# Altium project led-cube.PrjPcb
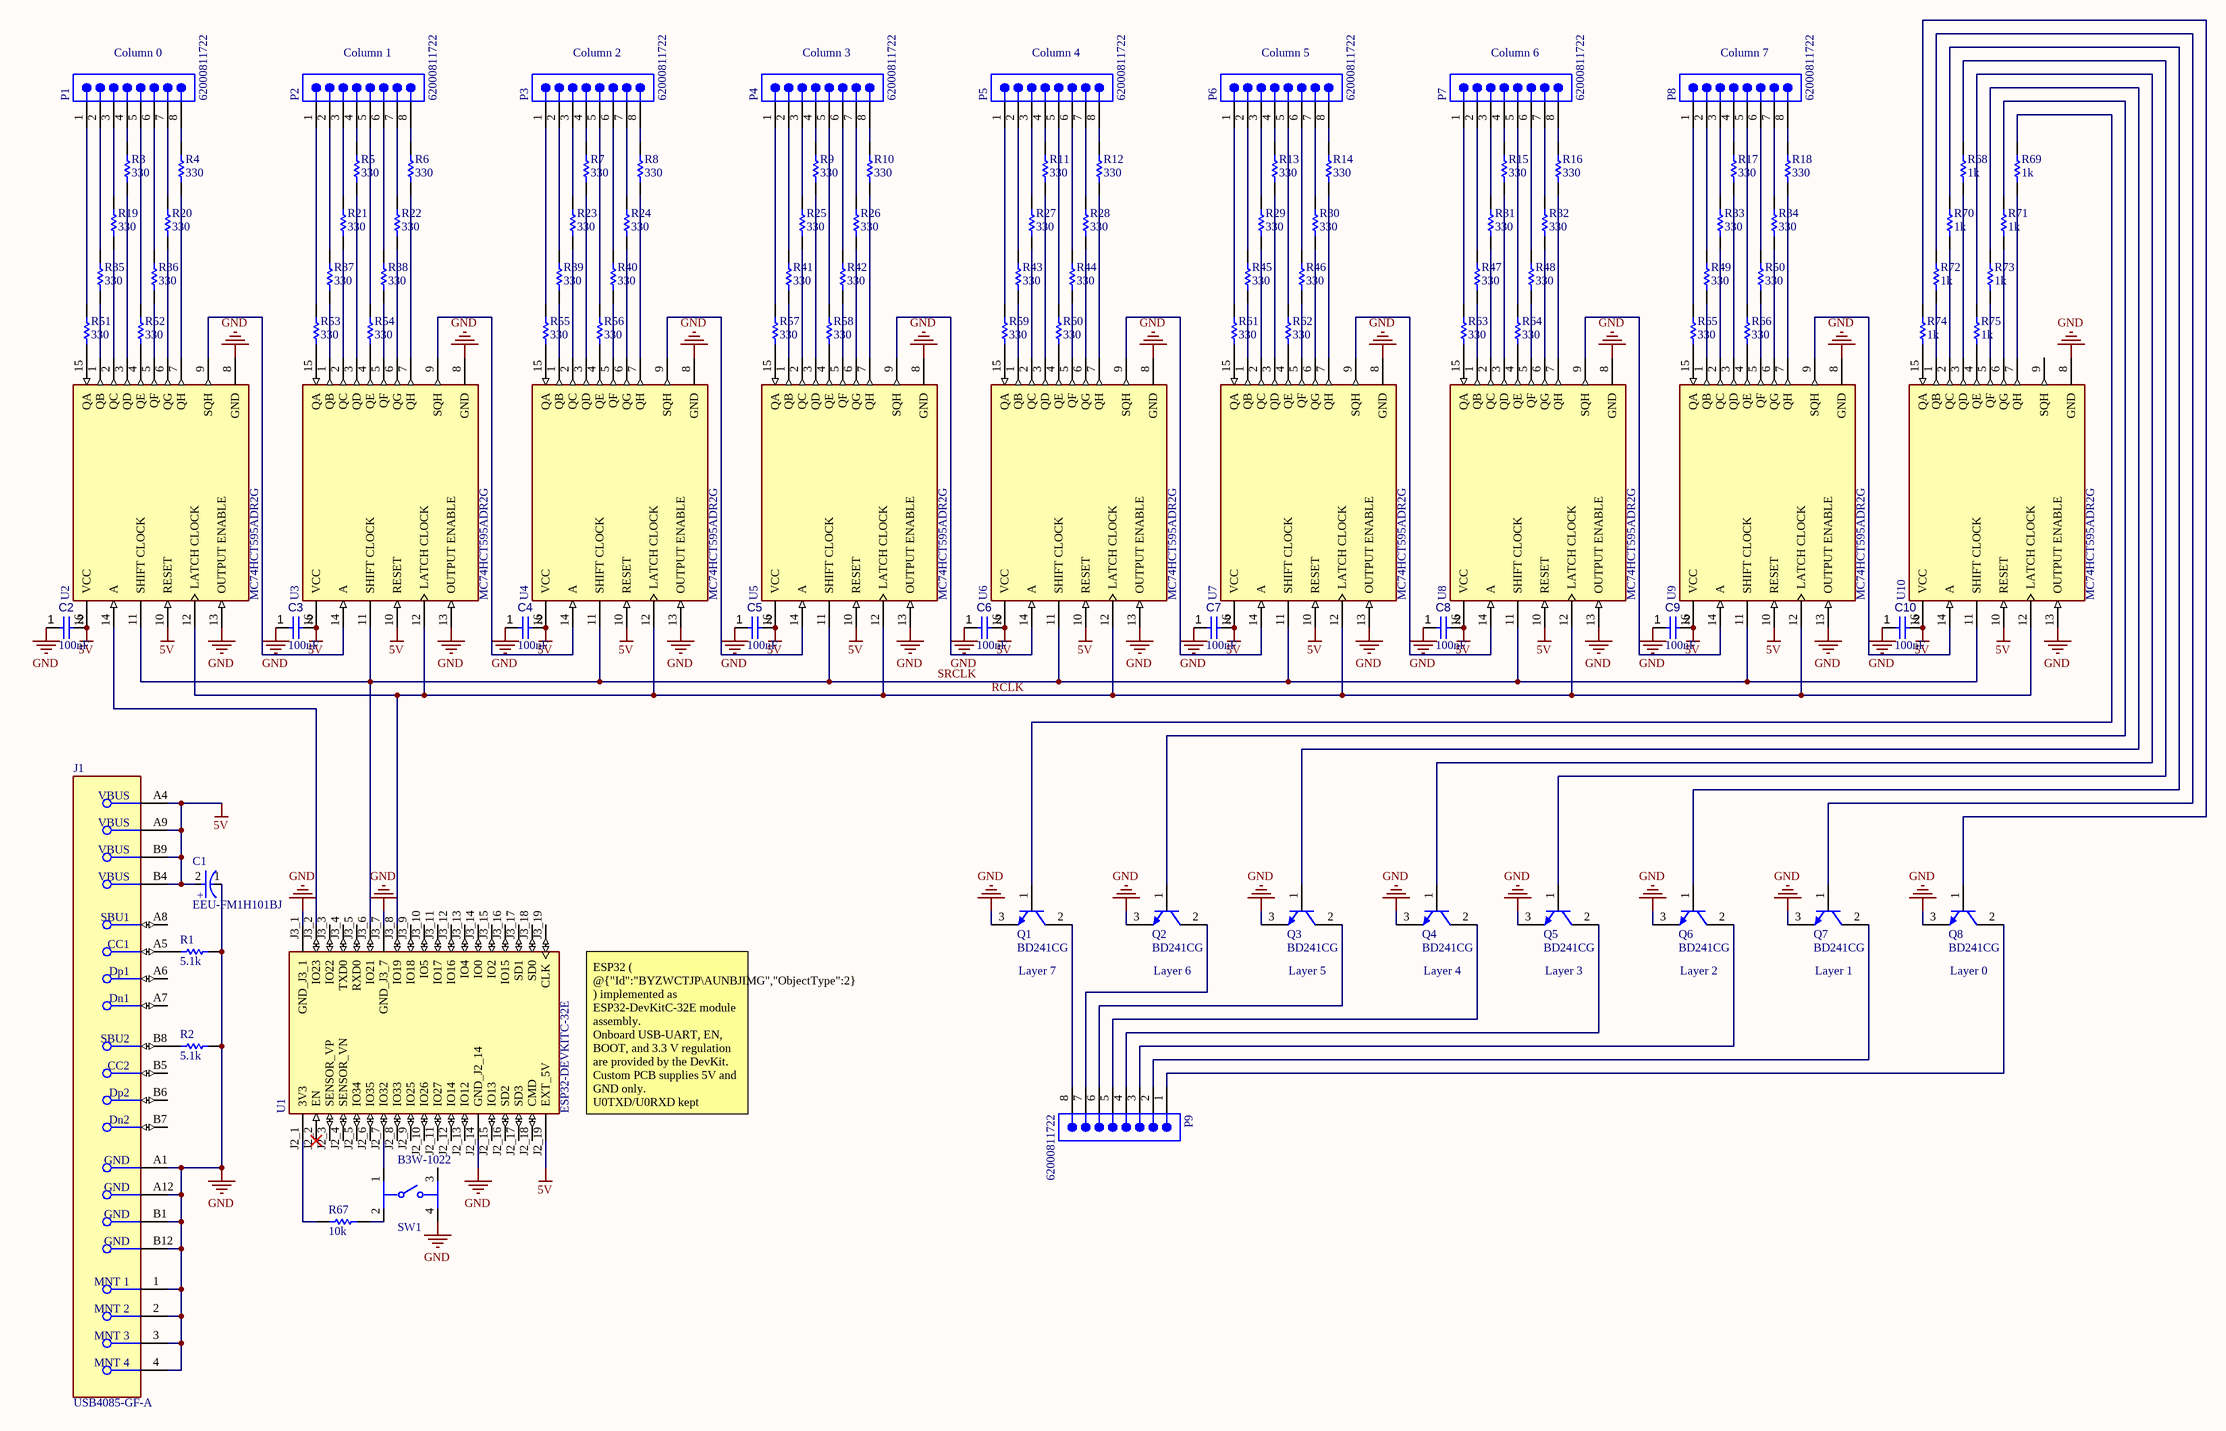
[diagram p0: Sheet1.SchDoc]
1 sheet, 114 parts. Net scope: global (net labels, ports and power ports of the same name join across sheets).

## Sheet Sheet1.SchDoc: LED Cube V1 Controller Schematic
size C; DrawnBy: Nikita J; Revision: A; SheetNumber: 1; SheetTotal: 1

### Parts
C1  EEU-FM1H101BJ  [FP-FM8-MFG]
C2  value 100nF  [CAPC0402(1005)60_L]  (hidden comment: Capacitor 100nF +/-20% 25V 0402)
C3  value 100nF  [CAPC0402(1005)60_L]  (hidden comment: Capacitor 100nF +/-20% 25V 0402)
C4  value 100nF  [CAPC0402(1005)60_L]  (hidden comment: Capacitor 100nF +/-20% 25V 0402)
C5  value 100nF  [CAPC0402(1005)60_L]  (hidden comment: Capacitor 100nF +/-20% 25V 0402)
C6  value 100nF  [CAPC0402(1005)60_L]  (hidden comment: Capacitor 100nF +/-20% 25V 0402)
C7  value 100nF  [CAPC0402(1005)60_L]  (hidden comment: Capacitor 100nF +/-20% 25V 0402)
C8  value 100nF  [CAPC0402(1005)60_L]  (hidden comment: Capacitor 100nF +/-20% 25V 0402)
C9  value 100nF  [CAPC0402(1005)60_L]  (hidden comment: Capacitor 100nF +/-20% 25V 0402)
C10  value 100nF  [CAPC0402(1005)60_L]  (hidden comment: Capacitor 100nF +/-20% 25V 0402)
J1  USB4085-GF-A  [FP-USB4085-GF-A-MFG]
P1  62000811722  [62000811722]
P2  62000811722  [62000811722]
P3  62000811722  [62000811722]
P4  62000811722  [62000811722]
P5  62000811722  [62000811722]
P6  62000811722  [62000811722]
P7  62000811722  [62000811722]
P8  62000811722  [62000811722]
P9  62000811722  [62000811722]
Q1  BD241CG  [ONSC-TO-220-3-221A-09]
Q2  BD241CG  [ONSC-TO-220-3-221A-09]
Q3  BD241CG  [ONSC-TO-220-3-221A-09]
Q4  BD241CG  [ONSC-TO-220-3-221A-09]
Q5  BD241CG  [ONSC-TO-220-3-221A-09]
Q6  BD241CG  [ONSC-TO-220-3-221A-09]
Q7  BD241CG  [ONSC-TO-220-3-221A-09]
Q8  BD241CG  [ONSC-TO-220-3-221A-09]
R1  value 5.1k  (hidden comment: Resistor)
R2  value 5.1k  (hidden comment: Resistor)
R3  value 330  (hidden comment: Resistor)
R4  value 330  (hidden comment: Resistor)
R5  value 330  (hidden comment: Resistor)
R6  value 330  (hidden comment: Resistor)
R7  value 330  (hidden comment: Resistor)
R8  value 330  (hidden comment: Resistor)
R9  value 330  (hidden comment: Resistor)
R10  value 330  (hidden comment: Resistor)
R11  value 330  (hidden comment: Resistor)
R12  value 330  (hidden comment: Resistor)
R13  value 330  (hidden comment: Resistor)
R14  value 330  (hidden comment: Resistor)
R15  value 330  (hidden comment: Resistor)
R16  value 330  (hidden comment: Resistor)
R17  value 330  (hidden comment: Resistor)
R18  value 330  (hidden comment: Resistor)
R19  value 330  (hidden comment: Resistor)
R20  value 330  (hidden comment: Resistor)
R21  value 330  (hidden comment: Resistor)
R22  value 330  (hidden comment: Resistor)
R23  value 330  (hidden comment: Resistor)
R24  value 330  (hidden comment: Resistor)
R25  value 330  (hidden comment: Resistor)
R26  value 330  (hidden comment: Resistor)
R27  value 330  (hidden comment: Resistor)
R28  value 330  (hidden comment: Resistor)
R29  value 330  (hidden comment: Resistor)
R30  value 330  (hidden comment: Resistor)
R31  value 330  (hidden comment: Resistor)
R32  value 330  (hidden comment: Resistor)
R33  value 330  (hidden comment: Resistor)
R34  value 330  (hidden comment: Resistor)
R35  value 330  (hidden comment: Resistor)
R36  value 330  (hidden comment: Resistor)
R37  value 330  (hidden comment: Resistor)
R38  value 330  (hidden comment: Resistor)
R39  value 330  (hidden comment: Resistor)
R40  value 330  (hidden comment: Resistor)
R41  value 330  (hidden comment: Resistor)
R42  value 330  (hidden comment: Resistor)
R43  value 330  (hidden comment: Resistor)
R44  value 330  (hidden comment: Resistor)
R45  value 330  (hidden comment: Resistor)
R46  value 330  (hidden comment: Resistor)
R47  value 330  (hidden comment: Resistor)
R48  value 330  (hidden comment: Resistor)
R49  value 330  (hidden comment: Resistor)
R50  value 330  (hidden comment: Resistor)
R51  value 330  (hidden comment: Resistor)
R52  value 330  (hidden comment: Resistor)
R53  value 330  (hidden comment: Resistor)
R54  value 330  (hidden comment: Resistor)
R55  value 330  (hidden comment: Resistor)
R56  value 330  (hidden comment: Resistor)
R57  value 330  (hidden comment: Resistor)
R58  value 330  (hidden comment: Resistor)
R59  value 330  (hidden comment: Resistor)
R60  value 330  (hidden comment: Resistor)
R61  value 330  (hidden comment: Resistor)
R62  value 330  (hidden comment: Resistor)
R63  value 330  (hidden comment: Resistor)
R64  value 330  (hidden comment: Resistor)
R65  value 330  (hidden comment: Resistor)
R66  value 330  (hidden comment: Resistor)
R67  value 10k  (hidden comment: Resistor)
R68  value 1k  (hidden comment: Resistor)
R69  value 1k  (hidden comment: Resistor)
R70  value 1k  (hidden comment: Resistor)
R71  value 1k  (hidden comment: Resistor)
R72  value 1k  (hidden comment: Resistor)
R73  value 1k  (hidden comment: Resistor)
R74  value 1k  (hidden comment: Resistor)
R75  value 1k  (hidden comment: Resistor)
SW1  B3W-1022  [FP-B3W-1022-MFG]
U1  ESP32-DEVKITC-32E  [MODULE_ESP32-DEVKITC-32E]
U2  MC74HCT595ADR2G  [FP-751B-05-MFG]
U3  MC74HCT595ADR2G  [FP-751B-05-MFG]
U4  MC74HCT595ADR2G  [FP-751B-05-MFG]
U5  MC74HCT595ADR2G  [FP-751B-05-MFG]
U6  MC74HCT595ADR2G  [FP-751B-05-MFG]
U7  MC74HCT595ADR2G  [FP-751B-05-MFG]
U8  MC74HCT595ADR2G  [FP-751B-05-MFG]
U9  MC74HCT595ADR2G  [FP-751B-05-MFG]
U10  MC74HCT595ADR2G  [FP-751B-05-MFG]

### Nets
5V: C1.2(A) C2.2 C3.2 C4.2 C5.2 C6.2 C7.2 C8.2 C9.2 C10.2 J1.A4(VBUS) J1.A9(VBUS) J1.B4(VBUS) J1.B9(VBUS) U1.J2_19(EXT_5V) U2.10(RESET) U2.16(VCC) U3.10(RESET) U3.16(VCC) U4.10(RESET) U4.16(VCC) U5.10(RESET) U5.16(VCC) U6.10(RESET) U6.16(VCC) U7.10(RESET) U7.16(VCC) U8.10(RESET) U8.16(VCC) U9.10(RESET) U9.16(VCC) U10.10(RESET) U10.16(VCC)
GND: C1.1(C) C2.1 C3.1 C4.1 C5.1 C6.1 C7.1 C8.1 C9.1 C10.1 J1.1(MNT_1) J1.2(MNT_2) J1.3(MNT_3) J1.4(MNT_4) J1.A1(GND) J1.A12(GND) J1.B1(GND) J1.B12(GND) Q1.3(E) Q2.3(E) Q3.3(E) Q4.3(E) Q5.3(E) Q6.3(E) Q7.3(E) Q8.3(E) R1.2 R2.2 SW1.4 U1.J2_14(GND_J2_14) U1.J3_1(GND_J3_1) U1.J3_7(GND_J3_7) U2.8(GND) U2.13(OUTPUT_ENABLE) U3.8(GND) U3.13(OUTPUT_ENABLE) U4.8(GND) U4.13(OUTPUT_ENABLE) U5.8(GND) U5.13(OUTPUT_ENABLE) U6.8(GND) U6.13(OUTPUT_ENABLE) U7.8(GND) U7.13(OUTPUT_ENABLE) U8.8(GND) U8.13(OUTPUT_ENABLE) U9.8(GND) U9.13(OUTPUT_ENABLE) U10.8(GND) U10.13(OUTPUT_ENABLE)
RCLK: U1.J3_8(IO19) U2.12(LATCH_CLOCK) U3.12(LATCH_CLOCK) U4.12(LATCH_CLOCK) U5.12(LATCH_CLOCK) U6.12(LATCH_CLOCK) U7.12(LATCH_CLOCK) U8.12(LATCH_CLOCK) U9.12(LATCH_CLOCK) U10.12(LATCH_CLOCK)
SRCLK: U1.J3_6(IO21) U2.11(SHIFT_CLOCK) U3.11(SHIFT_CLOCK) U4.11(SHIFT_CLOCK) U5.11(SHIFT_CLOCK) U6.11(SHIFT_CLOCK) U7.11(SHIFT_CLOCK) U8.11(SHIFT_CLOCK) U9.11(SHIFT_CLOCK) U10.11(SHIFT_CLOCK)
NetJ1_A5: J1.A5(CC1) R1.1
NetJ1_B8: J1.B8(SBU2) R2.1
NetP1_1: P1.1 R51.2
NetP1_2: P1.2 R35.2
NetP1_3: P1.3 R19.2
NetP1_4: P1.4 R3.2
NetP1_5: P1.5 R52.2
NetP1_6: P1.6 R36.2
NetP1_7: P1.7 R20.2
NetP1_8: P1.8 R4.2
NetP2_1: P2.1 R53.2
NetP2_2: P2.2 R37.2
NetP2_3: P2.3 R21.2
NetP2_4: P2.4 R5.2
NetP2_5: P2.5 R54.2
NetP2_6: P2.6 R38.2
NetP2_7: P2.7 R22.2
NetP2_8: P2.8 R6.2
NetP3_1: P3.1 R55.2
NetP3_2: P3.2 R39.2
NetP3_3: P3.3 R23.2
NetP3_4: P3.4 R7.2
NetP3_5: P3.5 R56.2
NetP3_6: P3.6 R40.2
NetP3_7: P3.7 R24.2
NetP3_8: P3.8 R8.2
NetP4_1: P4.1 R57.2
NetP4_2: P4.2 R41.2
NetP4_3: P4.3 R25.2
NetP4_4: P4.4 R9.2
NetP4_5: P4.5 R58.2
NetP4_6: P4.6 R42.2
NetP4_7: P4.7 R26.2
NetP4_8: P4.8 R10.2
NetP5_1: P5.1 R59.2
NetP5_2: P5.2 R43.2
NetP5_3: P5.3 R27.2
NetP5_4: P5.4 R11.2
NetP5_5: P5.5 R60.2
NetP5_6: P5.6 R44.2
NetP5_7: P5.7 R28.2
NetP5_8: P5.8 R12.2
NetP6_1: P6.1 R61.2
NetP6_2: P6.2 R45.2
NetP6_3: P6.3 R29.2
NetP6_4: P6.4 R13.2
NetP6_5: P6.5 R62.2
NetP6_6: P6.6 R46.2
NetP6_7: P6.7 R30.2
NetP6_8: P6.8 R14.2
NetP7_1: P7.1 R63.2
NetP7_2: P7.2 R47.2
NetP7_3: P7.3 R31.2
NetP7_4: P7.4 R15.2
NetP7_5: P7.5 R64.2
NetP7_6: P7.6 R48.2
NetP7_7: P7.7 R32.2
NetP7_8: P7.8 R16.2
NetP8_1: P8.1 R65.2
NetP8_2: P8.2 R49.2
NetP8_3: P8.3 R33.2
NetP8_4: P8.4 R17.2
NetP8_5: P8.5 R66.2
NetP8_6: P8.6 R50.2
NetP8_7: P8.7 R34.2
NetP8_8: P8.8 R18.2
NetP9_1: P9.1 Q8.2(C)
NetP9_2: P9.2 Q7.2(C)
NetP9_3: P9.3 Q6.2(C)
NetP9_4: P9.4 Q5.2(C)
NetP9_5: P9.5 Q4.2(C)
NetP9_6: P9.6 Q3.2(C)
NetP9_7: P9.7 Q2.2(C)
NetP9_8: P9.8 Q1.2(C)
NetQ1_1: Q1.1(B) R69.2
NetQ2_1: Q2.1(B) R71.2
NetQ3_1: Q3.1(B) R73.2
NetQ4_1: Q4.1(B) R75.2
NetQ5_1: Q5.1(B) R68.2
NetQ6_1: Q6.1(B) R70.2
NetQ7_1: Q7.1(B) R72.2
NetQ8_1: Q8.1(B) R74.2
NetR3_1: R3.1 U2.3(QD)
NetR4_1: R4.1 U2.7(QH)
NetR5_1: R5.1 U3.3(QD)
NetR6_1: R6.1 U3.7(QH)
NetR7_1: R7.1 U4.3(QD)
NetR8_1: R8.1 U4.7(QH)
NetR9_1: R9.1 U5.3(QD)
NetR10_1: R10.1 U5.7(QH)
NetR11_1: R11.1 U6.3(QD)
NetR12_1: R12.1 U6.7(QH)
NetR13_1: R13.1 U7.3(QD)
NetR14_1: R14.1 U7.7(QH)
NetR15_1: R15.1 U8.3(QD)
NetR16_1: R16.1 U8.7(QH)
NetR17_1: R17.1 U9.3(QD)
NetR18_1: R18.1 U9.7(QH)
NetR19_1: R19.1 U2.2(QC)
NetR20_1: R20.1 U2.6(QG)
NetR21_1: R21.1 U3.2(QC)
NetR22_1: R22.1 U3.6(QG)
NetR23_1: R23.1 U4.2(QC)
NetR24_1: R24.1 U4.6(QG)
NetR25_1: R25.1 U5.2(QC)
NetR26_1: R26.1 U5.6(QG)
NetR27_1: R27.1 U6.2(QC)
NetR28_1: R28.1 U6.6(QG)
NetR29_1: R29.1 U7.2(QC)
NetR30_1: R30.1 U7.6(QG)
NetR31_1: R31.1 U8.2(QC)
NetR32_1: R32.1 U8.6(QG)
NetR33_1: R33.1 U9.2(QC)
NetR34_1: R34.1 U9.6(QG)
NetR35_1: R35.1 U2.1(QB)
NetR36_1: R36.1 U2.5(QF)
NetR37_1: R37.1 U3.1(QB)
NetR38_1: R38.1 U3.5(QF)
NetR39_1: R39.1 U4.1(QB)
NetR40_1: R40.1 U4.5(QF)
NetR41_1: R41.1 U5.1(QB)
NetR42_1: R42.1 U5.5(QF)
NetR43_1: R43.1 U6.1(QB)
NetR44_1: R44.1 U6.5(QF)
NetR45_1: R45.1 U7.1(QB)
NetR46_1: R46.1 U7.5(QF)
NetR47_1: R47.1 U8.1(QB)
NetR48_1: R48.1 U8.5(QF)
NetR49_1: R49.1 U9.1(QB)
NetR50_1: R50.1 U9.5(QF)
NetR51_1: R51.1 U2.15(QA)
NetR52_1: R52.1 U2.4(QE)
NetR53_1: R53.1 U3.15(QA)
NetR54_1: R54.1 U3.4(QE)
NetR55_1: R55.1 U4.15(QA)
NetR56_1: R56.1 U4.4(QE)
NetR57_1: R57.1 U5.15(QA)
NetR58_1: R58.1 U5.4(QE)
NetR59_1: R59.1 U6.15(QA)
NetR60_1: R60.1 U6.4(QE)
NetR61_1: R61.1 U7.15(QA)
NetR62_1: R62.1 U7.4(QE)
NetR63_1: R63.1 U8.15(QA)
NetR64_1: R64.1 U8.4(QE)
NetR65_1: R65.1 U9.15(QA)
NetR66_1: R66.1 U9.4(QE)
NetR67_1: R67.1 SW1.2
NetR67_2: R67.2 U1.J2_1(3V3)
NetR68_1: R68.1 U10.3(QD)
NetR69_1: R69.1 U10.7(QH)
NetR70_1: R70.1 U10.2(QC)
NetR71_1: R71.1 U10.6(QG)
NetR72_1: R72.1 U10.1(QB)
NetR73_1: R73.1 U10.5(QF)
NetR74_1: R74.1 U10.15(QA)
NetR75_1: R75.1 U10.4(QE)
NetSW1_1: SW1.1 U1.J2_7(IO32)
NetU1_J3_2: U1.J3_2(IO23) U2.14(A)
NetU2_9: U2.9(SQH) U3.14(A)
NetU3_9: U3.9(SQH) U4.14(A)
NetU4_9: U4.9(SQH) U5.14(A)
NetU5_9: U5.9(SQH) U6.14(A)
NetU6_9: U6.9(SQH) U7.14(A)
NetU7_9: U7.9(SQH) U8.14(A)
NetU8_9: U8.9(SQH) U9.14(A)
NetU9_9: U9.9(SQH) U10.14(A)

Not connected (* = marked no-connect by the designer): J1 A6(Dp1) A7(Dn1) A8(SBU1) B5(CC2) B6(Dp2) B7(Dn2); SW1 3; U1 J2_2(EN)* J2_3(SENSOR_VP) J2_4(SENSOR_VN) J2_5(IO34) J2_6(IO35) J2_8(IO33) J2_9(IO25) J2_10(IO26) J2_11(IO27) J2_12(IO14) J2_13(IO12) J2_15(IO13) J2_16(SD2) J2_17(SD3) J2_18(CMD) J3_3(IO22) J3_4(TXD0) J3_5(RXD0) J3_9(IO18) J3_10(IO5) J3_11(IO17) J3_12(IO16) J3_13(IO4) J3_14(IO0) J3_15(IO2) J3_16(IO15) J3_17(SD1) J3_18(SD0) J3_19(CLK); U10 9(SQH)

### Notes on the sheet
- (near P1) Column 0
- (near P2) Column 1
- (near P3) Column 2
- (near P4) Column 3
- (near P5) Column 4
- (near P6) Column 5
- (near P7) Column 6
- (near P8) Column 7
- (near Q1) Layer 7
- (near Q2) Layer 6
- (near Q3) Layer 5
- (near Q4) Layer 4
- (near Q5) Layer 3
- (near Q6) Layer 2
- (near Q7) Layer 1
- (near Q8) Layer 0
- (near U1) ESP32 ( @{"Id":"BYZWCTJP\AUNBJIMG","ObjectType":2} ) implemented as ESP32-DevKitC-32E module assembly.
  Onboard USB-UART, EN, BOOT, and 3.3 V regulation are provided by the DevKit.
  Custom PCB supplies 5V and GND only.
  U0TXD/U0RXD kept available for flashing and serial debug.
- (in symbol CMP-05427-000021-1) +

### Library data of the parts
C1 = CMP-05427-000021-1: CAP ALUM 100UF 20% 50V RADIAL; Polarity: Polar; Impedance: 61mR; Ripple Current: 870mA; Life (Hours): 3000Hour; Dissipation Factor: 0.1%; Packaging: Ammo Pack; Voltage Rating (DC): 50V; Diameter: 8mm; Radiation Hardening: No; Max Operating Temperature: 105°C; Length: 11.5mm; Tolerance: 20%; Termination: Radial; Features: General Purpose; Case/Package: Radial; Voltage Rating: 50V; Min Operating Temperature: -40°C; Height - Seated (Max): 0.512inch; Mount: Through Hole; Series: FM; Height: 11.5mm; Capacitance: 100uF; ESR (Equivalent Series Resistance): 61mR; Lead Free: Lead Free; Lead Pitch: 0.197inch; Package Quantity: 1000
C2-C10 = CMP-001-00065-4: Chip Capacitor, 100nF +/-20%, 25V, 0402, Thickness 0.6 mm; Tolerance: 10%; Max Operating Temperature: 85°C; Min Operating Temperature: -55°C; Pins: 2; Voltage Rating: 25V; Mounting Technology: SMT; Case/Package: 0402
J1 = CMP-196119-000001-2: CONN RCPT USB2.0 TYPE C 24POS RA; Gender: Receptacle; Number of Positions: 16; USB Standard: USB 2.0; Orientation: Right Angle; Contact Plating: Gold; Contact Material: Copper Alloy
P1-P9 = CMP-1502-00657-3: WR-WTB Wire-to-Board Connectors 2.00 mm; Insulation Resistance: 1GΩ; Current Rating: 2A; Gender: Male; Pitch: 2mm; Max Operating Temperature: 85°C; Length: 18mm; Min Operating Temperature: -25°C; Contact Plating: Tin; Number of Pins: 8
Q1-Q8 = CMP-1048-01112-1: Complementary Silicon Plastic Power Transistor, 3-Pin TO-220, Pb-Free, Tube; Manufacturer: On Semiconductor; IC Continuous (A): 3; Polarity: NPN; Packing: Tube; PackageDescription: 3-Pin Flange Mount, Vertical Straight Lead, Body 9.97 x 4.445 mm, Pitch 2.54 mm; ComponentLink3URL: http://www.onsemi.com/pub_link/Collateral/221A-09.PDF; RoHS: TRUE; fT Min (MHz): 3; PackageReference: TO-220-3-221A-09; ComponentLink2URL: http://www.onsemi.com/pub_link/Collateral/BD241C-D.PDF; PartNumber: BD241CG; PackageVersion: Rev. AG, 09/2011; DatasheetVersion: Rev. 9; ComponentLink1Description: Manufacturer URL; ComponentLink3Description: Package Specification; ComponentLink2Description: Datasheet; Mounting Technology: Through Hole; ComponentLink1URL: http://www.onsemi.com/
R1-R75 = Resistor: TC1: 0; SimulationGenericComponent: True; TC2: 0
  R1 R2: Supplier 1: DigiKey; Supplier Part Number 1: 13-MFR-12FTF52-5K1CT-ND
SW1 = CMP-08834-000055-1: SWITCH TACTILE SPST-NO 0.05A 24V; Operating Force: 230gf; Switch Function: Off-Mom; Switch Travel: 0.25mm; Throw Configuration: SPST; Actuator Type: Standard; Illumination Type: Non-Illuminated; Ratings: IP67; Mechanical Life: 1000000Cycles; Packaging: Bulk; Termination: PC Pin; Max Operating Temperature: 70°C; RoHS Compliant: Yes; Mount: Through Hole; Min Operating Temperature: -25°C
U1 = CMP-018-000000-2: ESP32-WROOM-32E Series Evaluation Board 802.11 b/g/n (WiFi, WLAN) Bluetooth Smart Ready 4.x; MF: Espressif Systems; MP: ESP32-DEVKITC-32E; Design Item ID: ESP32-DEVKITC-32E; Pin Count: 38; SnapEDA_Link: https://www.snapeda.com/parts/ESP32-DEVKITC-32E/Espressif+Systems/view-part/?ref=snap; RoHS: Compliant; Component Type: Standard; Value: *; Package: None; Check_prices: https://www.snapeda.com/parts/ESP32-DEVKITC-32E/Espressif+Systems/view-part/?ref=eda; Source: ESP32-DEVKITC-32E.SchLib
U2-U10 = CMP-00278-20374953-1: MC74HCT595ADR2G Shift Register Single 8-Bit Serial to Serial/Parallel 16-Pin SOIC T/R - Tape and Reel; Manufacturer Lifecycle Status: ACTIVE; Number of Bits: 8; Turn-On Delay Time: 45ns; Number of Elements: 1; Operating Supply Voltage: 5V; Propagation Delay: 38ns; Direction: Unidirectional; Max Supply Voltage: 5.5V; Min Supply Voltage: 4.5V; Quiescent Current: 4µA; Lifecycle Status: Production; Case/Package: SOIC; Number of Bits per Element: 8; Logic Function: Shift Register; Lead Free: Lead Free; Packaging: Tape & Reel (TR); Number of Circuits: 1; Max Operating Temperature: 125°C; Halogen Free: Halogen Free; Number of Pins: 16; NexarPartId: 20374953; Schedule B: 8542390000, 8542390000; Contact Plating: Tin; RoHS: Compliant; Mount: Surface Mount; Min Operating Temperature: -55°C